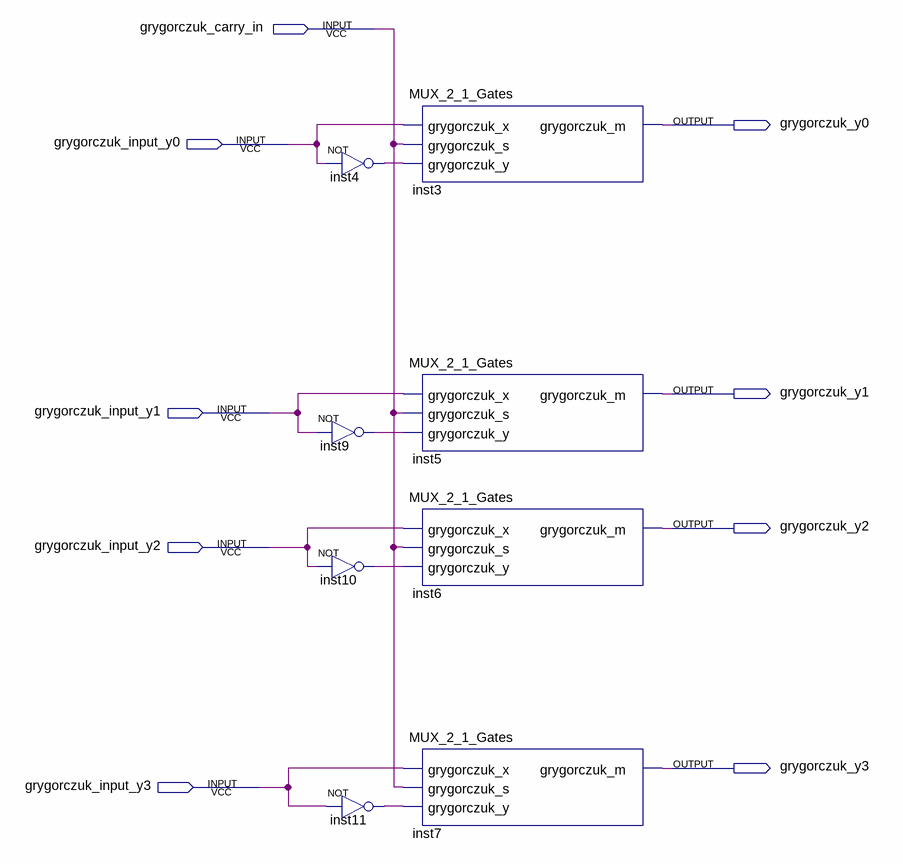
[diagram p0: schematic sheet]
// Quartus schematic TWOS_COMPLEMENT_4_BIT.bdf as structural Verilog: 8 symbols, 9 pins
module TWOS_COMPLEMENT_4_BIT (
  input  grygorczuk_carry_in,
  input  grygorczuk_input_y0,
  input  grygorczuk_input_y1,
  input  grygorczuk_input_y2,
  input  grygorczuk_input_y3,
  output grygorczuk_y0,
  output grygorczuk_y1,
  output grygorczuk_y2,
  output grygorczuk_y3
);

  wire inst4_out, inst9_out, inst10_out, inst11_out;

  not inst4 (inst4_out, grygorczuk_input_y0);
  not inst9 (inst9_out, grygorczuk_input_y1);
  not inst10 (inst10_out, grygorczuk_input_y2);
  not inst11 (inst11_out, grygorczuk_input_y3);
  MUX_2_1_Gates inst3 (
    .grygorczuk_x(grygorczuk_input_y0), .grygorczuk_s(grygorczuk_carry_in), .grygorczuk_y(inst4_out),
    .grygorczuk_m(grygorczuk_y0));
  MUX_2_1_Gates inst5 (
    .grygorczuk_x(grygorczuk_input_y1), .grygorczuk_s(grygorczuk_carry_in), .grygorczuk_y(inst9_out),
    .grygorczuk_m(grygorczuk_y1));
  MUX_2_1_Gates inst6 (
    .grygorczuk_x(grygorczuk_input_y2), .grygorczuk_s(grygorczuk_carry_in), .grygorczuk_y(inst10_out),
    .grygorczuk_m(grygorczuk_y2));
  MUX_2_1_Gates inst7 (
    .grygorczuk_x(grygorczuk_input_y3), .grygorczuk_s(grygorczuk_carry_in), .grygorczuk_y(inst11_out),
    .grygorczuk_m(grygorczuk_y3));
endmodule
